# Altium schematic sheet HBridge&Rectifier.SchDoc
size A4; SheetNumber: 3; SheetTotal: 3
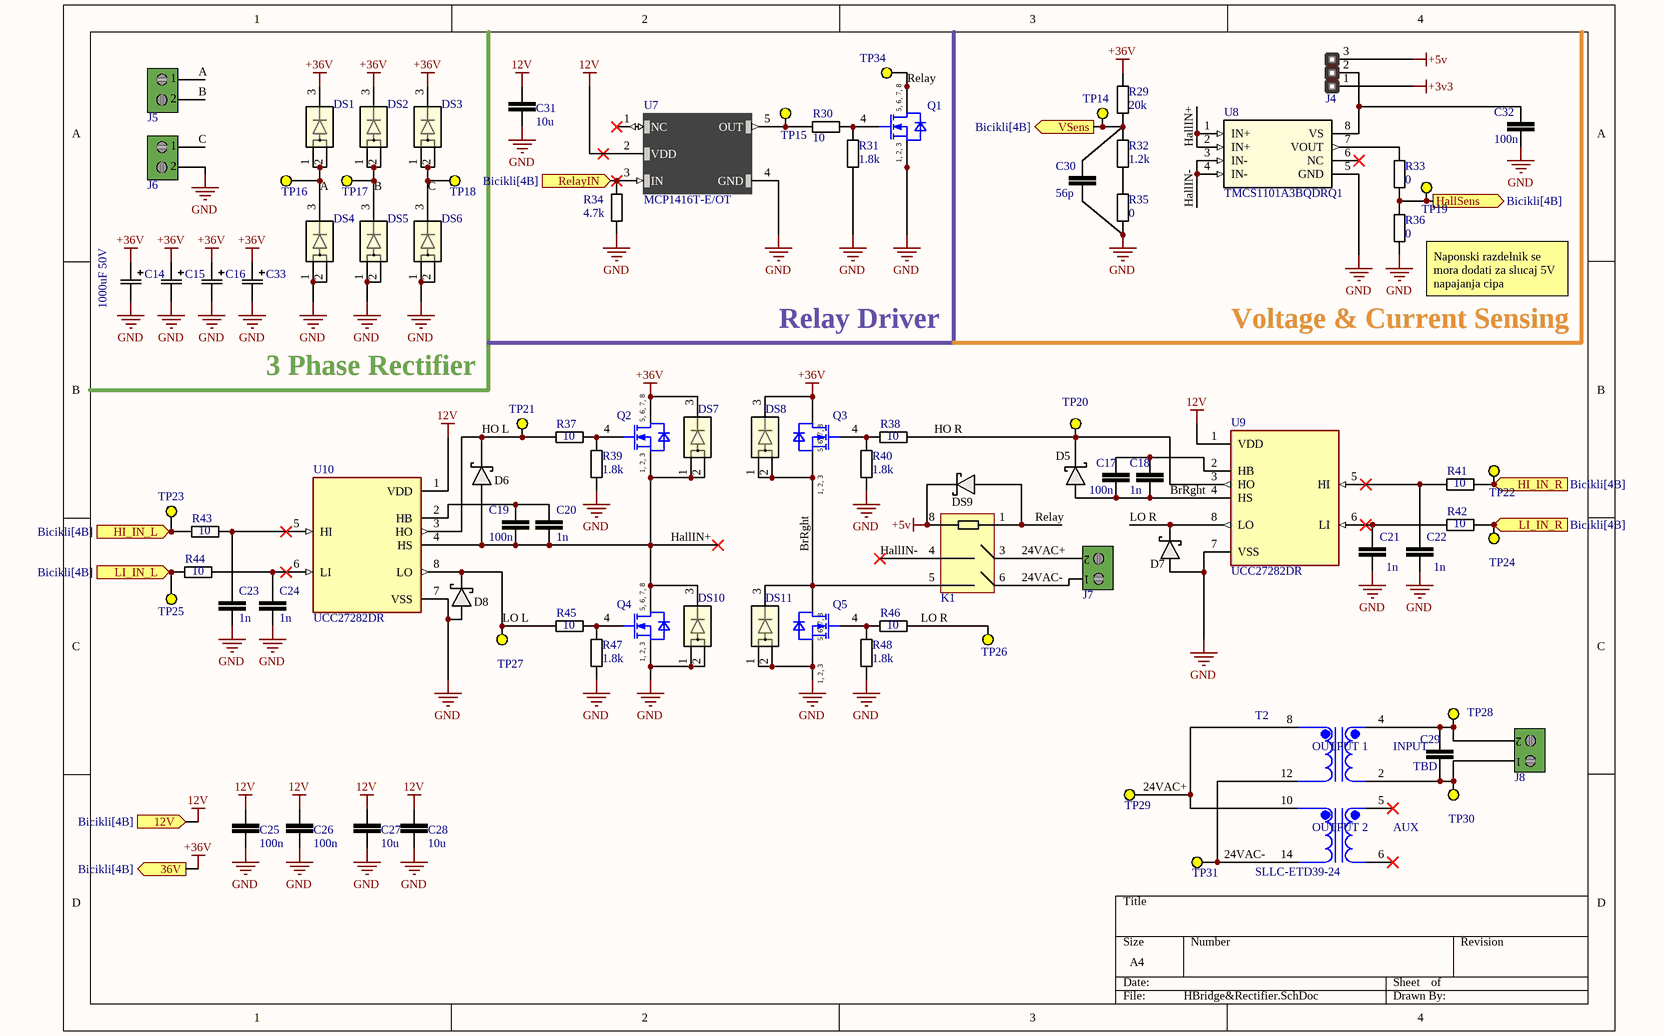
[diagram p0: HBridge&Rectifier.SchDoc]

## Parts
C14  1000uF 50V  [CAP_12.5 X 25_NCH]  (value not drawn)
C15  1000uF 50V  [CAP_12.5 X 25_NCH]  (value not drawn)
C16  1000uF 50V  [CAP_12.5 X 25_NCH]
C17  100n  [CAP_0805]
C18  1n  [CAP_0805]
C19  100n  [CAP_0805]
C20  1n  [CAP_0805]
C21  1n  [CAP_0805]
C22  1n  [CAP_0805]
C23  1n  [CAP_0805]
C24  1n  [CAP_0805]
C25  100n  [CAP_0805]
C26  100n  [CAP_0805]
C27  10u  [CAP_1206]
C28  10u  [CAP_1206]
C29  TBD  [CapacitorBig]
C30  56p  [CAP_0805]
C31  10u  [CAP_1206]
C32  100n  [CAP_0805]
C33  1000uF 50V  [CAP_12.5 X 25_NCH]  (value not drawn)
D5  SCH_DIODE  [SMA]  (value not drawn)
D6  SCH_DIODE  [SMA]  (value not drawn)
D7  SCH_DIODE  [SMA]  (value not drawn)
D8  SCH_DIODE  [SMA]  (value not drawn)
DS1  PMEG45U10EPDZ  [PMEG45U10EPDZ_NEX]  (value not drawn)
DS2  PMEG45U10EPDZ  [PMEG45U10EPDZ_NEX]  (value not drawn)
DS3  PMEG45U10EPDZ  [PMEG45U10EPDZ_NEX]  (value not drawn)
DS4  PMEG45U10EPDZ  [PMEG45U10EPDZ_NEX]  (value not drawn)
DS5  PMEG45U10EPDZ  [PMEG45U10EPDZ_NEX]  (value not drawn)
DS6  PMEG45U10EPDZ  [PMEG45U10EPDZ_NEX]  (value not drawn)
DS7  PMEG45U10EPDZ  [PMEG45U10EPDZ_NEX]  (value not drawn)
DS8  PMEG45U10EPDZ  [PMEG45U10EPDZ_NEX]  (value not drawn)
DS9  SCH_DIODE  [SMA]  (value not drawn)
DS10  PMEG45U10EPDZ  [PMEG45U10EPDZ_NEX]  (value not drawn)
DS11  PMEG45U10EPDZ  [PMEG45U10EPDZ_NEX]  (value not drawn)
J4  3Pin  [HEADER3PIN]  (value not drawn)
J5  Wire Terminal Block 2 pin 5mm  [WireTerminalPCB5mm2PIN]  (value not drawn)
J6  Wire Terminal Block 2 pin 5mm  [WireTerminalPCB5mm2PIN]  (value not drawn)
J7  Wire Terminal Block 2 pin 5mm  [WireTerminalPCB5mm2PIN]  (value not drawn)
J8  Wire Terminal Block 2 pin 5mm  [WireTerminalPCB5mm2PIN]  (value not drawn)
K1  K1  [AZ733-2AE-5DE]  (value not drawn)
Q1  IQE022N06LM5  [IFX-PG-TSON-8-5-V]  (value not drawn)
Q2  IQE022N06LM5  [IFX-PG-TSON-8-5-V]  (value not drawn)
Q3  IQE022N06LM5  [IFX-PG-TSON-8-5-V]  (value not drawn)
Q4  IQE022N06LM5  [IFX-PG-TSON-8-5-V]  (value not drawn)
Q5  IQE022N06LM5  [IFX-PG-TSON-8-5-V]  (value not drawn)
R29  20k  [RESISTOR_0805]
R30  10  [RESISTOR_0805]
R31  1.8k  [RESISTOR_0805]
R32  1.2k  [RESISTOR_0805]
R33  0  [RESISTOR_0805]
R34  4.7k  [RESISTOR_0805]
R35  0  [RESISTOR_0805]
R36  0  [RESISTOR_0805]
R37  10  [RESISTOR_1206]
R38  10  [RESISTOR_1206]
R39  1.8k  [RESISTOR_1206]
R40  1.8k  [RESISTOR_1206]
R41  10  [RESISTOR_1206]
R42  10  [RESISTOR_1206]
R43  10  [RESISTOR_1206]
R44  10  [RESISTOR_1206]
R45  10  [RESISTOR_1206]
R46  10  [RESISTOR_1206]
R47  1.8k  [RESISTOR_1206]
R48  1.8k  [RESISTOR_1206]
T2  SLLC-ETD39-24  [XFMR_SLLC-ETD39-48]
TP14  TP  [TP]  (value not drawn)
TP15  TP  [TP]  (value not drawn)
TP16  TP  [TP]  (value not drawn)
TP17  TP  [TP]  (value not drawn)
TP18  TP  [TP]  (value not drawn)
TP19  TP  [TP]  (value not drawn)
TP20  TP  [TP]  (value not drawn)
TP21  TP  [TP]  (value not drawn)
TP22  TP  [TP]  (value not drawn)
TP23  TP  [TP]  (value not drawn)
TP24  TP  [TP]  (value not drawn)
TP25  TP  [TP]  (value not drawn)
TP26  TP  [TP]  (value not drawn)
TP27  TP  [TP]  (value not drawn)
TP28  TP  [TP]  (value not drawn)
TP29  TP  [TP]  (value not drawn)
TP30  TP  [TP]  (value not drawn)
TP31  TP  [TP]  (value not drawn)
TP34  TP  [TP]  (value not drawn)
U7  MCP1416T-E/OT  [SOT95P270X145-5N]
U8  TMCS1101A3BQDRQ1  [SOIC8_D_TEX]
U9  UCC27282DR  [SOIC127P599X175-8N]
U10  UCC27282DR  [SOIC127P599X175-8N]

## Ports
12V (in, see Bicikli[4B]), 36V (out, see Bicikli[4B]), HallSens (out, see Bicikli[4B]), HI_IN_L (in, see Bicikli[4B]), HI_IN_R (in, see Bicikli[4B]), LI_IN_L (in, see Bicikli[4B]), LI_IN_R (in, see Bicikli[4B]), RelayIN (in, see Bicikli[4B]), VSens (out, see Bicikli[4B])

## Nets
12V: C25.2 C26.2 C27.2 C28.2 C31.2 U7.2(VDD) U9.1(VDD) U10.1(VDD) ; port 12V
+3v3: J4.1
+5v: DS9.2 J4.3 K1.8
+36V: C14.1 C15.1 C16.1 C33.1 DS1.3 DS2.3 DS3.3 DS7.3 DS8.3 Q2.5(DRAIN) Q2.6(DRAIN) Q2.7(DRAIN) Q2.8(DRAIN) Q3.5(DRAIN) Q3.6(DRAIN) Q3.7(DRAIN) Q3.8(DRAIN) R29.2 ; port 36V
GND: C14.2 C15.2 C16.2 C21.1 C22.1 C23.1 C24.1 C25.1 C26.1 C27.1 C28.1 C30.1 C31.1 C32.1 C33.2 D7.1 D8.1 DS4.1 DS4.2 DS5.1 DS5.2 DS6.1 DS6.2 DS10.1 DS10.2 DS11.1 DS11.2 J6.2 Q1.1(SOURCE) Q1.2(SOURCE) Q1.3(SOURCE) Q4.1(SOURCE) Q4.2(SOURCE) Q4.3(SOURCE) Q5.1(SOURCE) Q5.2(SOURCE) Q5.3(SOURCE) R31.1 R34.1 R35.1 R36.1 R39.1 R40.1 R47.1 R48.1 U7.4(GND) U8.5(GND) U9.7(VSS) U10.7(VSS)
24VAC+: J7.2 K1.3 T2.8 T2.10 TP29.1
24VAC-: J7.1 K1.6 T2.12 T2.14 TP31.1
A: DS1.1 DS1.2 DS4.3 J5.1 TP16.1
B: DS2.1 DS2.2 DS5.3 J5.2 TP17.1
BrRght: C17.1 C18.1 D5.1 DS8.1 DS8.2 DS11.3 K1.5 Q3.1(SOURCE) Q3.2(SOURCE) Q3.3(SOURCE) Q5.5(DRAIN) Q5.6(DRAIN) Q5.7(DRAIN) Q5.8(DRAIN) U9.4(HS)
C: DS3.1 DS3.2 DS6.3 J6.1 TP18.1
HallIN+: C19.1 C20.1 D6.1 DS7.1 DS7.2 DS10.3 Q2.1(SOURCE) Q2.2(SOURCE) Q2.3(SOURCE) Q4.5(DRAIN) Q4.6(DRAIN) Q4.7(DRAIN) Q4.8(DRAIN) U8.1(IN+) U8.2(IN+) U10.4(HS)
HallIN-: K1.4 U8.3(IN-) U8.4(IN-)
HallSens: R33.1 R36.2 TP19.1 ; port HallSens
HI_IN_L: R43.1 TP23.1 ; port HI_IN_L
HI_IN_R: R41.2 TP22.1 ; port HI_IN_R
HO L: D6.2 R37.1 TP21.1 U10.3(HO)
HO R: D5.2 R38.2 TP20.1 U9.3(HO)
LI_IN_L: R44.1 TP25.1 ; port LI_IN_L
LI_IN_R: R42.2 TP24.1 ; port LI_IN_R
LO L: D8.2 R45.1 TP27.1 U10.8(LO)
LO R: D7.2 R46.2 TP26.1 U9.8(LO)
Relay: DS9.1 K1.1 Q1.5(DRAIN) Q1.6(DRAIN) Q1.7(DRAIN) Q1.8(DRAIN) TP34.1
RelayIN: R34.2 U7.3(IN) ; port RelayIN
VSens: C30.2 R29.1 R32.2 TP14.1 ; port VSens
NetC17_2: C17.2 C18.2 U9.2(HB)
NetC19_2: C19.2 C20.2 U10.2(HB)
NetC21_2: C21.2 R42.1 U9.6(LI)
NetC22_2: C22.2 R41.1 U9.5(HI)
NetC23_2: C23.2 R43.2 U10.5(HI)
NetC24_2: C24.2 R44.2 U10.6(LI)
NetC29_1: C29.1 J8.1 T2.2 TP30.1
NetC29_2: C29.2 J8.2 T2.4 TP28.1
NetC32_2: C32.2 J4.2 U8.8(VS)
NetQ1_4: Q1.4(GATE) R30.2 R31.2
NetQ2_4: Q2.4(GATE) R37.2 R39.2
NetQ3_4: Q3.4(GATE) R38.1 R40.2
NetQ4_4: Q4.4(GATE) R45.2 R47.2
NetQ5_4: Q5.4(GATE) R46.1 R48.2
NetR30_1: R30.1 TP15.1 U7.5(OUT)
NetR32_1: R32.1 R35.2
NetR33_2: R33.2 U8.7(VOUT)

Not connected (* = marked no-connect by the designer): T2 5* 6*; U7 1(NC)*; U8 6(NC)*

## Notes on the sheet
- (near R36) Naponski razdelnik se mora dodati za slucaj 5V napajanja cipa
- 3 Phase Rectifier
- Relay Driver
- Voltage & Current Sensing
- (in symbol IQE022N06LM5) 5, 6, 7, 8; 1, 2, 3
- (in symbol SLLC-ETD39-48) OUTPUT 1; INPUT; OUTPUT 2; AUX

## Library data of the parts
C14-C16 C33 = UVY1H102MHD: Manufacturer_Name: Nichicon; Copyright: Copyright (C) 2025 Ultra Librarian. All rights reserved.; Manufacturer_Part_Number: UVY1H102MHD
C17 C19 C25 C26 C32 = C00079: CAP 100nF ±10% 50V 0805 X7R; capacitance: 100n
C18 C20-C24 = C00059: CAP 1nF ±10% 50V 0805 X7R; capacitance: 1n
C27 C28 C31 = C00085: CAP 10uF ±10% 10V 0805 X5R; capacitance: 10u
C29 = C00059: CAP 1nF ±10% 50V 0805 X7R; capacitance: 1n
C30 = C00039: CAP 56pF ±5% 50V 0805 C0G; capacitance: 56p
DS1-DS8 DS10 DS11 = PMEG45U10EPDZ: No Description Available; Manufacturer_Name: Nexperia; Copyright: Copyright (C) 2025 Ultra Librarian. All rights reserved.; Manufacturer_Part_Number: PMEG45U10EPDZ; RefDes: RefDes; Type: Type
J4 = HEADER3PIN: 3 PIN Male Header 2.54mm pitch
J5-J8 = Wire Terminal Block 2 pin 5mm: Wire Terminal PCB Block 2 pin 5mm
K1 = Relay: AZ733-2AE-5DE Relay
Q1-Q5 = IQE022N06LM5: Insulated-Gate Field-Effect Transistor (IGFET), N-Channel, Enhancement, Body Diode, Pin 1 Source, 2 Source, 3 Source, 4 Gate, 5 Drain, 6 Drain, 7 Drain, 8 Drain, 8 Pins; Manufacturer: Infineon Technologies; PackageReference: PG-TSON-8-5; Manufacturer Order Number: IQE022N06LM5
R29 = R000054: RES  20k OHM 1% 1/8W 0805; resistance: 20k
R30 R37 R38 R41-R46 = R000002: RES  10 OHM 1% 1/8W 0805; resistance: 10
R31 R39 R40 R47 R48 = R000060: RES  1k8 OHM 1% 1/8W 0805; resistance: 2.2k
R32 = R000018: RES  1k2 OHM 1% 1/8W 0805; resistance: 1.2k
R33 R35 R36 = R000000: RES  0 OHM JUMPER 1/8W 0805; resistance: 1; Supplier 1: Mouser; Supplier Part Number 1: 71-CRCW0805-1-E3; Supplier 2: Mouser; Supplier Part Number 2: 667-ERJ-6RQF1R0V; Supplier 3: Mouser; Supplier Part Number 3: 667-ERJ-6BQF1R0V
R34 = R000116: RES  4k7 OHM 1% 1/8W 0805; resistance: 4.7k
T2 = SLLC-ETD39-48: High Frequency Resonant Transformers; MF: Signal Transformer; SnapEDA_Link: https://www.snapeda.com/parts/SLLC-ETD39-48/Signal+Transformer/view-part/?ref=snap; Package: None; Value: *; MP: SLLC-ETD39-48; Check_prices: https://www.snapeda.com/parts/SLLC-ETD39-48/Signal+Transformer/view-part/?ref=eda
TP14-TP31 TP34 = TP: Test Point 1.5mm radius
U7 = MCP1416T-E/OT: Low-Side Gate Driver IC Non-Inverting SOT-23-5; MF: Microchip; Price: None; Availability: Good; SnapEDA_Link: https://www.snapeda.com/parts/MCP1416T-E/OT/Microchip/view-part/287469/?ref=snap; Package: SOT-23-5 Microchip; MP: MCP1416T-E/OT; Value: *; Purchase-URL: https://pricing.snapeda.com/search/part/MCP1416T-E/OT/?ref=eda; Check_prices: https://www.snapeda.com/parts/MCP1416T-E/OT/Microchip/view-part/287469/?ref=eda
U8 = TMCS1101A3BQDRQ1: AEC-Q100, Â±600-V,Â precision, isolated current sensor with internal reference 8-SOIC -40 to 125; Manufacturer_Name: Texas Instruments; Copyright: Copyright (C) 2025 Ultra Librarian. All rights reserved.; Manufacturer_Part_Number: TMCS1101A3BQDRQ1; Datasheet: https://www.ti.com/lit/gpn/tmcs1101-q1; RefDes: RefDes; Type: Type
U9 U10 = UCC27282DR: 3-A, 120-V half-bridge gate driver with 5-V UVLO, interlock and enable; MF: Texas Instruments; SnapEDA_Link: https://www.snapeda.com/parts/UCC27282DR/Texas+Instruments/view-part/?ref=snap; Package: None; Value: *; MP: UCC27282DR; Check_prices: https://www.snapeda.com/parts/UCC27282DR/Texas+Instruments/view-part/?ref=eda